# EAGLE design blinkenrocket_cr2032 (EAGLE 6.6.0)
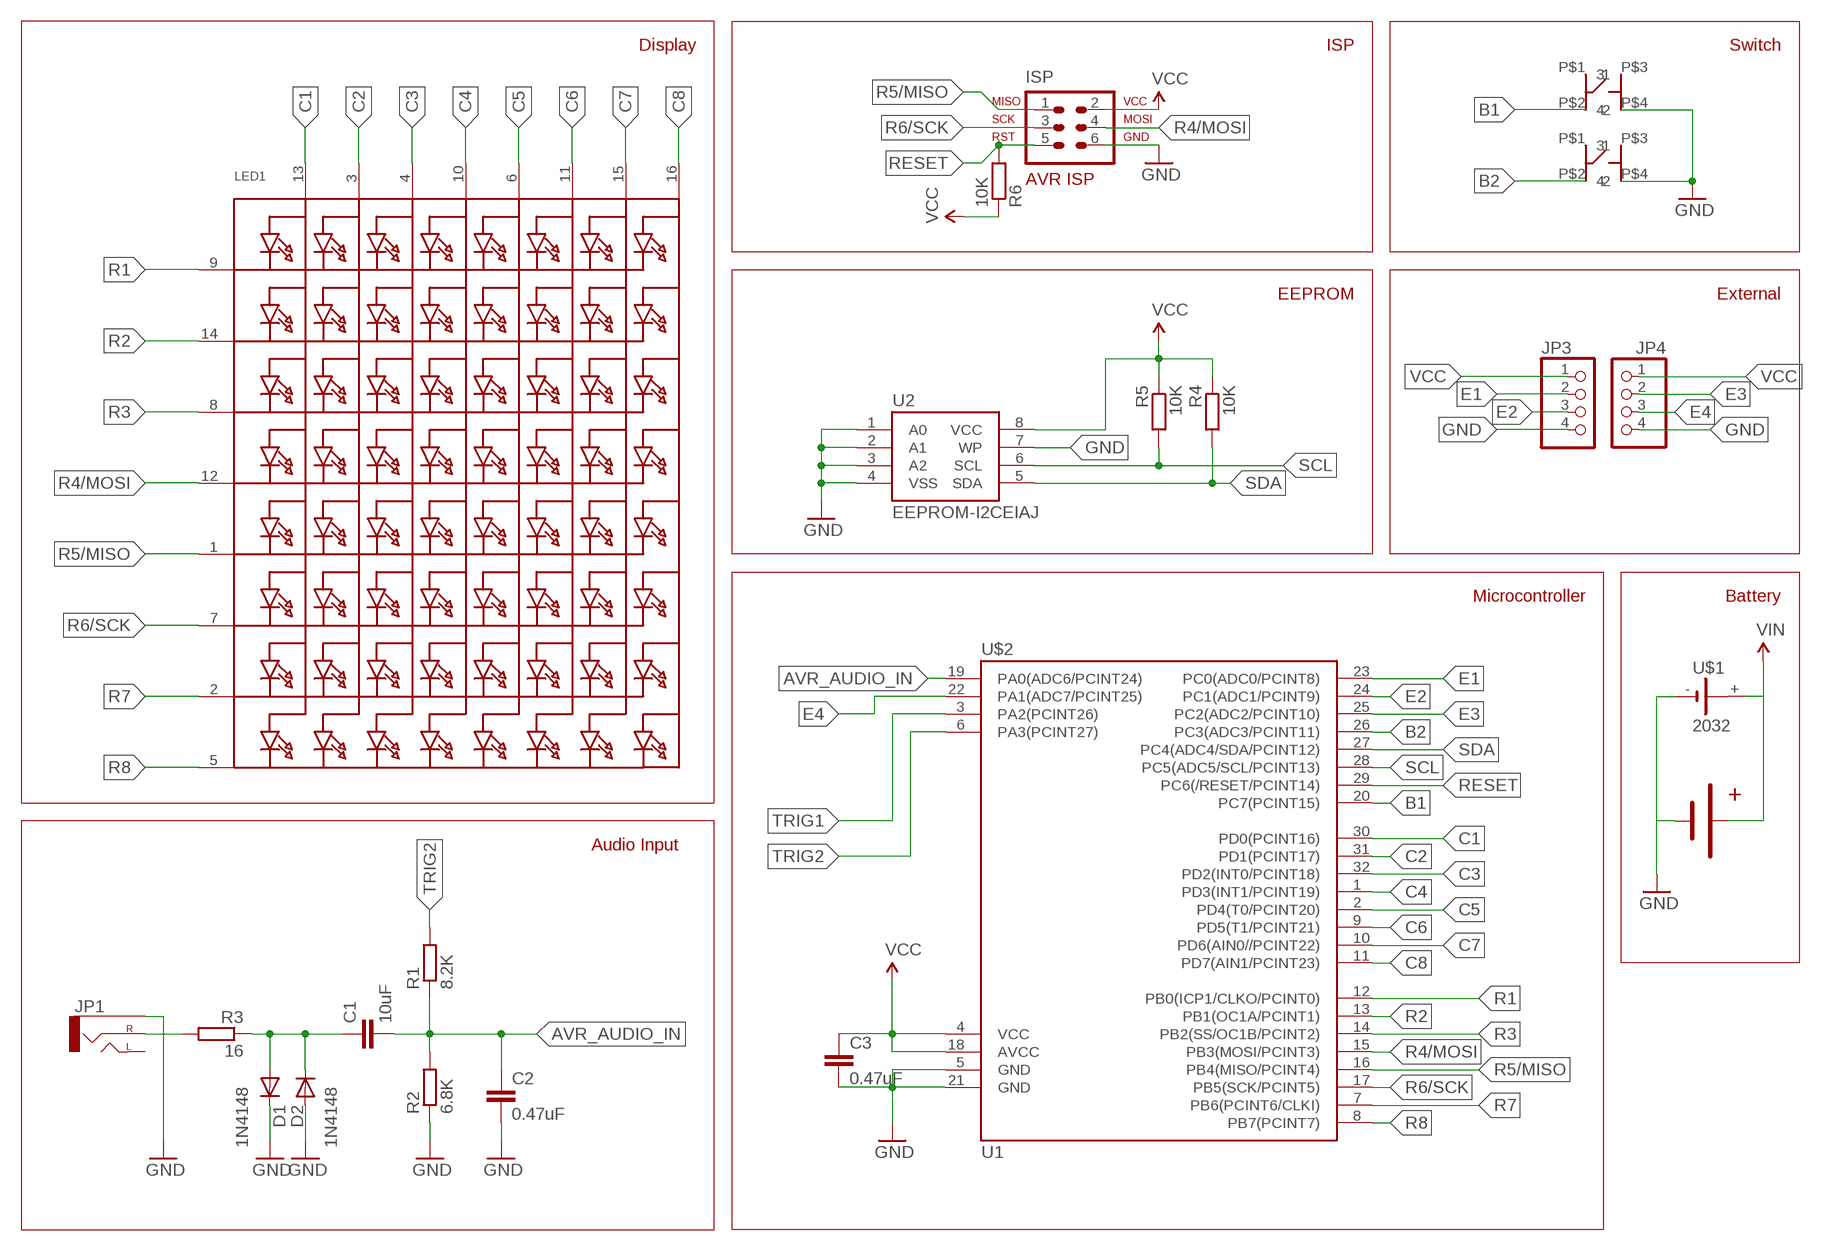
[diagram p0: schematic, sheet 1]

## Parts
C1  10uF  C-EUC1206  [C1206]
C2  0.47uF  C-EUC1206  [C1206]
C3  0.47uF  C-EUC1206  [C1206]
D1  1N4148  DIODE_SOD-123  [SOD3718X135N]
D2  1N4148  DIODE_SOD-123  [SOD3718X135N]
ISP  AVR-ISP-6VERT  [AVR-ISP-6]
JP1  AUDIO-JACKPTH  [AUDIO-JACK]
JP3  PINHD-1X04_2.54-S  [1X04-S]
JP4  PINHD-1X04_2.54-S  [1X04-S]
LED1  SEGMENT_8X8_ROWCATHODEM12A881UR  [SEGMENT_BL-M12A881UR]
R1  8.2K  R-EU_R1206  [R1206]
R2  6.8K  R-EU_R1206  [R1206]
R3  16  R-EU_R1206  [R1206]
R4  10K  R-EU_R1206  [R1206]
R5  10K  R-EU_R1206  [R1206]
R6  10K  R-EU_R1206  [R1206]
SW1  SWITCH-4POMRON-6-6-SWITCH  [4P-OMRON-6-6-SWITCH]
SW2  SWITCH-4POMRON-6-6-SWITCH  [4P-OMRON-6-6-SWITCH]
U2  EEPROM-I2CEIAJ  [SO08-EIAJ]
U$1  2032  [KZH20SMD]
U$2  U1  TINY48/88B  [TQFP32-08]
U$3  BATTERYPAD  [BATTERYPAD]

## Nets
AVR_AUDIO_IN: C1.2 C2.1 R1.1 R2.2 U$2.19(PA0(ADC6/PCINT24))
B1: SW2.P$2 U$2.20(PC7(PCINT15))
B2: SW1.P$2 U$2.26(PC3(ADC3/PCINT11))
C1: LED1.13(A1) U$2.30(PD0(PCINT16))
C2: LED1.3(A2) U$2.31(PD1(PCINT17))
C3: LED1.4(A3) U$2.32(PD2(INT0/PCINT18))
C4: LED1.10(A4) U$2.1(PD3(INT1/PCINT19))
C5: LED1.6(A5) U$2.2(PD4(T0/PCINT20))
C6: LED1.11(A6) U$2.9(PD5(T1/PCINT21))
C7: LED1.15(A7) U$2.10(PD6(AIN0//PCINT22))
C8: LED1.16(A8) U$2.11(PD7(AIN1/PCINT23))
E1: JP3.2 U$2.23(PC0(ADC0/PCINT8))
E2: JP3.3 U$2.24(PC1(ADC1/PCINT9))
E3: JP4.2 U$2.25(PC2(ADC2/PCINT10))
E4: JP4.3 U$2.22(PA1(ADC7/PCINT25))
GND: C2.2 C3.2 D1.K D2.A ISP.6 JP1.SLEEVE JP3.4 JP4.4 R2.1 SW1.P$4 SW2.P$4 U2.1(A0) U2.2(A1) U2.3(A2) U2.4(VSS) U2.7(WP) U$1.- U$2.5(GND) U$2.21(GND) U$3.-VE
N$1: JP1.RING(RIGHT) R3.2
N$3: C1.1 D1.A D2.K R3.1
R1: LED1.9(K1) U$2.12(PB0(ICP1/CLKO/PCINT0))
R2: LED1.14(K2) U$2.13(PB1(OC1A/PCINT1))
R3: LED1.8(K3) U$2.14(PB2(SS/OC1B/PCINT2))
R4/MOSI: ISP.4 LED1.12(K4) U$2.15(PB3(MOSI/PCINT3))
R5/MISO: ISP.1 LED1.1(K5) U$2.16(PB4(MISO/PCINT4))
R6/SCK: ISP.3 LED1.7(K6) U$2.17(PB5(SCK/PCINT5))
R7: LED1.2(K7) U$2.7(PB6(PCINT6/CLKI))
R8: LED1.5(K8) U$2.8(PB7(PCINT7))
RESET: ISP.5 R6.2 U$2.29(PC6(/RESET/PCINT14))
SCL: R5.2 U2.6(SCL) U$2.28(PC5(ADC5/SCL/PCINT13))
SDA: R4.2 U2.5(SDA) U$2.27(PC4(ADC4/SDA/PCINT12))
TRIG1: U$2.3(PA2(PCINT26))
TRIG2: R1.2 U$2.6(PA3(PCINT27))
VCC: C3.1 ISP.2 JP3.1 JP4.1 R4.1 R5.1 R6.1 U2.8(VCC) U$1.+ U$2.4(VCC) U$2.18(AVCC) U$3.+VE ; supply symbol labelled VIN
Unconnected: JP1.TIP(LEFT) SW1.P$1 SW1.P$3 SW2.P$1 SW2.P$3

## Notes on the sheet
- Display | ISP | Switch
- EEPROM | External
- Microcontroller | Battery
- Audio Input

## Library data of the parts
C1-C3 = resistor:C-EU: CAPACITOR, European symbol
D1 D2 = ipc-7351-diode:DIODE_
ISP = avr-7:AVR-ISP-6: AVR ISP-6 Serial Programming Header
JP1 = SparkFun-Connectors:AUDIO-JACK: 3.5mm Audio Jack Simple 3.5mm common PCB mount audio jack. SKU: PRT-08032
JP3 JP4 = pinhead-2:PINHD-1X04: PIN HEADER
LED1 = adafruit:SEGMENT_8X8_ROWCATHODE: 8x8 LED Segment Displays: Row = Cathode 0.7" Red 8X8 Matrix, 1.9mm Round LEDs - BL-M07C881UR 1.2" Red 8x8 Matrix, 3.0mm Round LEDs - BL-M12A881UR 1.2" Red 8x8 Matrix, 3.0mm Square LEDs - BL-M12A883
R1-R6 = resistor:R-EU_: RESISTOR, European symbol
SW1 SW2 = switch:SWITCH-4P
U2 = SparkFun-DigitalIC:EEPROM-I2C: I2C EEPROM chips, 24LC256 (and others)
U$1 = kzh20_lithium_batterie_holder:2032
U$2 = avr-muzy:TINY48/88
U$3 = computronics.com.au:BATTERYPAD: Battery Pads to add external battery

## Board
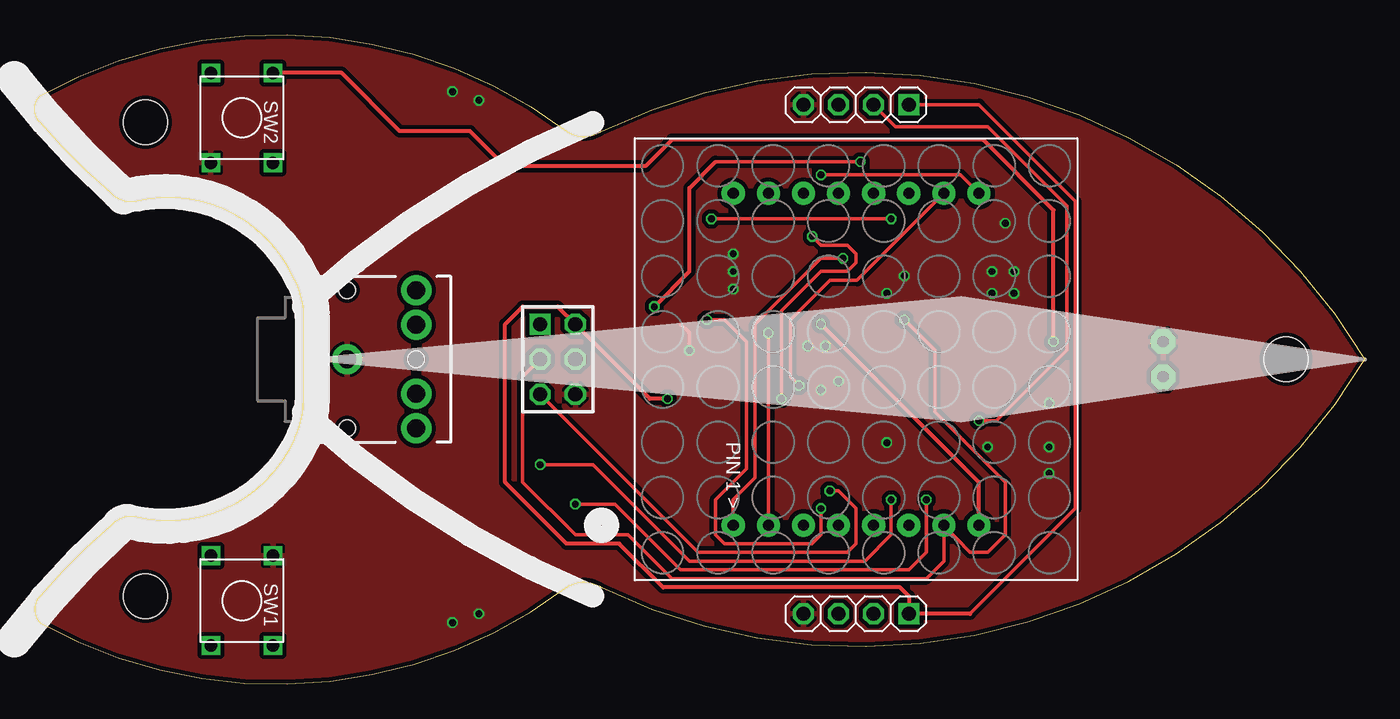
[diagram p1: board, top side]
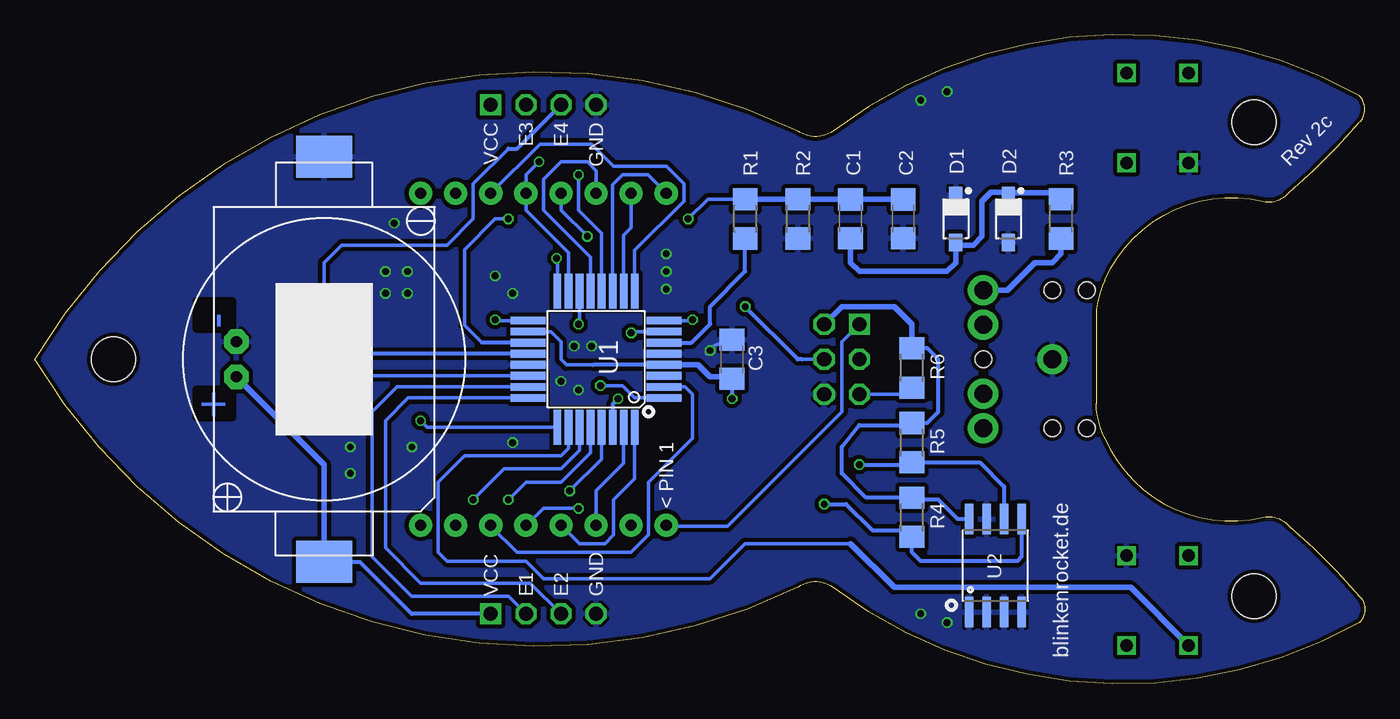
[diagram p2: board, bottom side, seen from below]

Size 96.29 x 46.98 mm. Coordinates in mm from the lower left corner, seen from the top.
Outline: 18.82,29.21 arc80 7.39,34.92 arc-60 5.48,35.56 arc-10 0.4,40.64 arc-92 0.4,42.54 arc-66 38.5,40 arc70 41.04,40 arc-85 96.29,23.49 arc-85 41.04,6.98 arc70 38.5,6.98 arc-66 0.4,4.44 arc-92 0.4,6.35 arc-10 5.48,11.43 arc-60 7.39,12.06 arc80 18.82,17.78 arc25 19.45,20.32 19.45,26.67 arc25 18.82,29.21
Copper layers (1*16): Top 0.018mm / dielectric 1.55mm / Bottom 0.018mm
Design rules "Multi-CB_2L_125Êm-Tracks_OL35Êm": minimum track width 0.125mm, minimum drill 0.2mm, track to track 0.125mm, track to pad 0.125mm, pad to pad 0.125mm, via to via 0.125mm, smd to smd 0mil, copper to edge 0.2mm, drill to drill 0.2mm, minimum pad ring 0.125mm, minimum via ring 0.125mm, stop-mask expansion 2mil, vias tented up to drill 0.45mm, thermal gap 0.2mm
Holes 3.2 mm at 90.57,23.49 8.02,40.64 8.02,6.35

### Footprints (pad centres in the part's own frame; a part is rotated, then mirrored left to right if it is on the bottom)
C1206 = smd 1.6 x 1.8: 1 -1.4,0; 2 1.4,0
SOD3718X135N = smd 1.27 x 0.965: A 1.7,0; K -1.7,0
AVR-ISP-6 = drill 1.016 square: 1 -2.54,-1.27 | drill 1.016 octagon: 2 -2.54,1.27; 3 0,-1.27; 4 0,1.27; 5 2.54,-1.27; 6 2.54,1.27
AUDIO-JACK = drill 1.3 pad 2.184: RING 5,5; RSH 5,2.5; SLEEVE 0,0; TIP 5,-5; TSH 5,-2.5 | hole 1.2: 0,5; -2.5,5; -2.5,-5; 0,-5; 5,0
1X04-S = drill 1.016 square: 1 -3.81,0 | drill 1.016 octagon: 2 -1.27,0; 3 1.27,0; 4 3.81,0
SEGMENT_BL-M12A881UR = drill 0.8 pad 1.676: 1 -8.89,-12; 2 -6.35,-12; 3 -3.81,-12; 4 -1.27,-12; 5 1.27,-12; 6 3.81,-12; 7 6.35,-12; 8 8.89,-12; 9 8.89,12; 10 6.35,12; 11 3.81,12; 12 1.27,12; 13 -1.27,12; 14 -3.81,12; 15 -6.35,12; 16 -8.89,12
R1206 = smd 1.6 x 1.803: 1 -1.422,0; 2 1.422,0
4P-OMRON-6-6-SWITCH = drill 0.9 square: P$1 -3.25,-2.25; P$2 -3.25,2.25; P$3 3.25,2.25; P$4 3.25,-2.25
SO08-EIAJ = smd 0.61 x 2.21: 1 -1.905,-3.378; 2 -0.635,-3.378; 3 0.635,-3.378; 4 1.905,-3.378; 5 1.905,3.353; 6 0.635,3.353; 7 -0.635,3.353; 8 -1.905,3.353
KZH20SMD = smd 3.048 x 4.064: + 14.65,0; - -14.65,0
TQFP32-08 = smd 2.54 x 0.559: 1 -4.928,2.8; 2 -4.928,2; 3 -4.928,1.2; 4 -4.928,0.4; 5 -4.928,-0.4; 6 -4.928,-1.2; 7 -4.928,-2; 8 -4.928,-2.8; 17 4.928,-2.8; 18 4.928,-2; 19 4.928,-1.2; 20 4.928,-0.4; 21 4.928,0.4; 22 4.928,1.2; 23 4.928,2; 24 4.928,2.8 | smd 0.559 x 2.54: 9 -2.8,-4.928; 10 -2,-4.928; 11 -1.2,-4.928; 12 -0.4,-4.928; 13 0.4,-4.928; 14 1.2,-4.928; 15 2,-4.928; 16 2.8,-4.928; 25 2.8,4.928; 26 2,4.928; 27 1.2,4.928; 28 0.4,4.928; 29 -0.4,4.928; 30 -1.2,4.928; 31 -2,4.928; 32 -2.8,4.928
BATTERYPAD = drill 0.813 pad 1.778 octagon: +VE -1.27,0; -VE 1.27,0

### Placement (x,y rotation side)
C1  37.23,33.65 90 bottom
C2  33.42,33.65 270 bottom
C3  45.8,23.49 90 bottom
D1  29.61,33.65 270 bottom
D2  25.8,33.65 270 bottom
ISP  37.87,23.49 270 top
JP1  22.63,23.49 0 top
JP3  59.46,5.08 180 top
JP4  59.46,41.91 180 top
LED1  59.46,23.49 0 top
R1  44.85,33.65 270 bottom
R2  41.04,33.65 90 bottom
R3  21.99,33.65 270 bottom
R4  32.79,12.06 270 bottom
R5  32.79,17.46 270 bottom
R6  32.79,22.86 270 bottom
SW1  15.01,6.03 90 top
SW2  15.01,40.95 270 top
U2  26.75,8.57 0 bottom
U$1  75.33,23.49 270 bottom
U$2  55.65,23.49 180 bottom
U$3  81.68,23.49 90 bottom

### Tracks (layer width: path | path; a pad name or v marks a point on that pad's centre or on a via)
AVR_AUDIO_IN  (via drill 0.5)
  Top 0.254: v48.98,33.65 v62,33.65
  Bottom 0.254: R1.1 47.56,35.07 v48.98,33.65 | v62,33.65 62.95,33.65 65.17,31.43 65.17,25.96 63.9,24.69
  Bottom 0.305: U$2.19 63.9,24.69
  Bottom 0.406: C2.1 C1.2 41.02,35.05 R2.2 R1.1
B1  (via drill 0.5 pad 0.25)
  Top 0.305: v73.74,24.76 73.74,34.29 68.66,39.37 46.12,39.37 44.22,37.46 34.06,37.46 31.52,40 26.44,40 22.23,44.2 SW2.P$2
  Bottom 0.305: U$2.20 72.87,23.89 v73.74,24.76
B2
  Bottom 0.254: U$2.26 57.65,17.05 58.19,16.51 65.17,16.51 67.08,14.6 67.08,9.52 66.44,8.89 60.73,8.89 59.46,7.62 47.39,7.62 44.85,10.16 37.23,10.16
  Bottom 0.406: SW1.P$2 16.96,6.98 34.06,6.98 37.23,10.16
C1  (via drill 0.5, 0.5 pad 0.25)
  Top 0.254: v54.06,20.63 54.06,26.98 56.92,29.84 58.82,29.84 59.46,30.48 59.46,31.11 58.82,31.75 56.92,31.75 v56.28,32.38
  Bottom 0.254: v56.28,32.38 58.19,34.29 LED1.13
  Bottom 0.305: v54.06,20.63 54.45,20.25 U$2.30
C2
  Bottom 0.254: U$2.31 53.65,15.97 55.65,13.97 LED1.3
C3
  Bottom 0.254: U$2.32 52.85,14.86 54.38,13.33 54.38,10.79 55.01,10.16 56.85,10.16 LED1.4
C4  (via drill 0.5 pad 0.25)
  Top 0.254: LED1.10 59.52,29.21 57.55,29.21 54.69,26.35 54.69,22.22 v55.33,21.59
  Bottom 0.254: v55.33,21.59 53.74,21.59 52.85,20.69 U$2.1
C5
  Bottom 0.254: LED1.6 63.27,11.43 61.36,9.52 53.11,9.52 51.84,10.79 51.84,14.6 48.66,17.78 48.66,20.95 49.2,21.49 U$2.2
C6
  Bottom 0.254: U$2.9 52.85,31.37 49.3,34.92 49.3,36.19 50.57,37.46 54.38,37.46 55.96,39.05 59.71,39.05 LED1.11
C7
  Bottom 0.254: U$2.10 53.65,32.48 53.11,33.02 LED1.15
C8
  Bottom 0.254: U$2.11 54.45,36.12 53.74,36.83 51.9,36.83 LED1.16
E1
  Bottom 0.254: U$2.23 70.03,21.49 71.84,19.68 71.84,9.2 68.98,6.35 62,6.35 JP3.2
E2
  Bottom 0.254: U$2.24 69.24,20.69 70.89,19.05 70.89,9.84 68.35,7.3 60.41,7.3 JP3.3
E3  (via drill 0.5)
  Top 0.254: JP4.2 62.31,40.32 68.98,40.32 74.7,34.6 74.7,24.13 69.62,19.05 v68.35,19.05
  Bottom 0.254: v68.35,19.05 67.86,18.56 U$2.25
E4
  Bottom 0.254: 62,38.73 64.54,36.19 64.54,33.65 66.44,31.75 74.06,31.75 75.33,30.48 75.33,23.81 73.81,22.29 U$2.22
  Bottom 0.305: 62,38.73 61.36,38.73 JP4.3
GND  (via drill 0.5 pad 0.25)
  Top 0.305: v47.39,24.13 47.39,25.4 46.76,26.03
  Bottom 0.254: C3.2 47.03,24.49 v47.39,24.13
  Bottom 0.305: 47.63,23.89 v47.39,24.13
  other vias: 58.19,21.9 56.92,21.27 73.43,15.24 69.3,28.25 70.89,29.84 69.3,29.84 70.25,33.33 68.98,17.14 61.68,28.25 50.57,29.84 62.95,29.52 70.89,28.25 50.57,28.57 50.57,31.11 61.68,17.46 73.43,17.14 73.43,20.32 55.96,24.44 57.23,24.44 32.15,5.08 30.25,4.44 32.15,42.22 30.25,42.86
  pour Bottom (isolate 0.305): 104.54,57.78 -36.43,60.32 -61.19,-3.18 -3.41,-5.72 93.75,-40.01
  pour Top (isolate 0.305): -49.76,59.05 -35.16,63.5 -26.9,63.5 -24.36,60.96 -16.74,58.42 -13.57,60.32 -8.49,62.23 -6.58,64.13 1.04,63.5 14.37,60.32 18.82,64.13 26.44,60.96 30.88,64.13 49.93,64.77 56.92,68.58 68.35,64.77 76.6,69.21 86.76,71.12 100.1,65.4 104.54,60.96 112.8,59.05 119.78,52.7 132.48,33.02 122.96,23.49 130.58,12.06 123.59,5.08 129.94,-32.39 76.6,-48.26 42.95,-45.09 15.64,-49.53 -1.5,-22.23 -40.87,-9.53
N$1
  Bottom 0.406: 21.51,32.23 R3.2 21.99,31.11 22.63,30.48 23.9,30.48 25.88,28.49 JP1.RING
N$3
  Bottom 0.305: 25.8,35.55 D2.K
  Bottom 0.406: R3.1 22.47,35.55 25.8,35.55 | D2.K 25.81,35.56 27.07,35.56 27.71,34.92 27.71,32.38 28.34,31.75 29.61,31.75 D1.A 29.61,30.48 30.25,29.84 36.6,29.84 37.23,30.48 C1.1
R1  (via drill 0.5 pad 0.25)
  Top 0.254: v56.92,36.83 67.01,36.83 LED1.9
  Bottom 0.254: U$2.12 55.25,32.62 56.92,34.29 v56.92,36.83
R2
  Bottom 0.254: LED1.14 55.65,37.14 56.28,37.78 58.19,37.78 59.46,36.51 59.46,34.29 56.05,30.88 U$2.13
R3  (via drill 0.5 pad 0.25)
  Top 0.305: LED1.8 68.35,14.6 v56.92,26.03
  Bottom 0.254: v56.92,26.03 56.85,26.1 U$2.14
R4/MOSI  (via drill 0.5, 0.5 pad 0.25)
  Top 0.254: 49.3,37.78 v59.77,37.78
  Top 0.305: v44.85,27.3 47.39,29.84 47.39,35.87 49.3,37.78
  Bottom 0.254: U$2.15 57.65,31.21 60.73,34.29 LED1.12 60.73,36.83 v59.77,37.78 | 40.72,23.49 ISP.4
  Bottom 0.305: 40.72,23.49 41.04,23.49 v44.85,27.3
R5/MISO  (via drill 0.5 pad 0.25)
  Top 0.254: LED1.1 50.57,13.33 52.15,14.92 52.15,26.03 56.92,30.79 v58.5,30.79
  Bottom 0.254: v58.5,30.79 58.45,30.74 U$2.16 | ISP.1 37.87,24.76 37.87,19.68 46.12,11.43 50.5,11.43 LED1.1
R6/SCK  (via drill 0.5)
  Top 0.254: ISP.3 35.33,22.22 35.33,14.6 39.14,10.79 42.95,10.79 46.12,7.62 64.54,7.62 65.81,8.89 LED1.7 67.71,9.52 68.98,9.52 70.25,10.79 70.25,14.6 65.17,19.68 65.17,24.13 v62.95,26.35
  Bottom 0.254: v62.95,26.35 62.89,26.29 U$2.17
R7  (via drill 0.5 pad 0.25)
  Top 0.254: v53.11,25.4 LED1.2
  Bottom 0.254: U$2.7 53.01,25.49 v53.11,25.4
R8  (via drill 0.5 pad 0.25)
  Top 0.254: v48.66,26.35 49.93,26.35 51.52,24.76 51.52,15.55 49.3,13.33 49.3,10.79 49.93,10.16 56.28,10.16 56.92,10.79 v56.92,12.7
  Bottom 0.254: U$2.8 48.72,26.29 arc-90 v48.66,26.35 | LED1.5 59.46,12.7 v56.92,12.7
RESET  (via drill 0.5 pad 0.25)
  Top 0.254: v57.55,13.97 58.19,13.97 59.46,12.7 59.46,10.16 58.82,9.52 48.03,9.52 ISP.5
  Bottom 0.254: U$2.29 55.25,16.27 v57.55,13.97 | ISP.5 32.79,20.95 R6.2
SCL  (via drill 0.5 pad 0.25)
  Top 0.254: v62,13.33 62,10.79 60.09,8.89 47.39,8.89 40.41,15.87 v36.6,15.87
  Bottom 0.254: U$2.28 56.05,16.74 58.19,14.6 60.73,14.6 v62,13.33
  Bottom 0.305: U2.6 26.12,14.28 27.87,16.04 R5.2 32.79,15.87 v36.6,15.87
SDA  (via drill 0.5 pad 0.25)
  Top 0.254: v64.54,13.33 64.54,9.52 63.27,8.25 46.76,8.25 41.99,13.01 v39.14,13.01
  Bottom 0.254: U$2.27 56.85,16.89 58.19,15.55 62.31,15.55 v64.54,13.33 | 38.82,13.01 v39.14,13.01
  Bottom 0.305: U2.5 24.85,9.2 25.17,8.89 32.15,8.89 32.79,9.52 R4.2 32.79,11.11 35.64,11.11 37.55,13.01 38.82,13.01
TRIG2
  Bottom 0.305: U$2.6 48.73,24.69 47.39,26.03 47.39,27.3 44.85,29.84 R1.2
VCC  (via drill 0.5 pad 0.25)
  Top 0.254: JP4.1 68.35,41.91 75.33,34.92 75.33,12.7 67.71,5.08
  Top 0.305: v45.8,20.63 44.53,20.63 ISP.2 37.87,27.3 35.33,27.3 34.06,26.03 34.06,14.6 38.5,10.16 42.31,10.16 45.49,6.98 62.63,6.98 63.27,6.35 JP3.1 67.71,5.08
  Bottom 0.254: 55.88,23.09 57.79,23.09 58.19,23.49 58.19,24.76 58.92,25.49 U$2.18
  Bottom 0.305: U$2.4 55.88,23.09 | U$1.+ 72.75,8.84 68.98,5.08 JP3.1 | C3.1 v45.8,20.63 | R6.1 31.67,24.28 30.88,23.49 30.88,19.68 31.68,18.88 R5.1 32.94,18.73 36.6,18.73 37.87,17.14 37.87,15.24 36.11,13.48 R4.1 32.63,13.33 30.88,13.33 29.47,11.92 U2.8
  Bottom 0.406: ISP.2 37.87,27.3 34.06,27.3 32.79,26.03 R6.1 | U$3.+VE 75.33,15.87 U$1.+ | U$2.4 48.26,23.09 47.39,22.22 45.93,22.22 C3.1

### Text on the board
tNames: PIN 1 >
bNames: Rev 2c | GND | E4 | E3 | VCC | < PIN 1 | GND | E2 | E1 | VCC | blinkenrocket.de